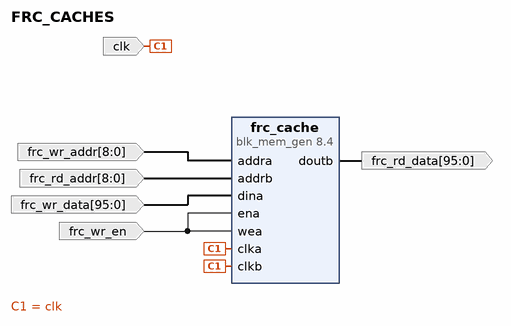
[diagram p0: block diagram of the top level]
# Vivado block design FRC_CACHES, xcu280-fsvh2892-2L-e, Vivado 2021.2
create_bd_design FRC_CACHES

create_bd_port -dir I -type clk clk
create_bd_port -dir I -from 8 -to 0 frc_rd_addr
create_bd_port -dir O -from 95 -to 0 frc_rd_data
create_bd_port -dir I -from 8 -to 0 frc_wr_addr
create_bd_port -dir I -from 95 -to 0 frc_wr_data
create_bd_port -dir I frc_wr_en

create_bd_cell -type ip -vlnv xilinx.com:ip:blk_mem_gen:8.4 frc_cache
set_property -dict [list \
  CONFIG.Assume_Synchronous_Clk true \
  CONFIG.Collision_Warnings ALL \
  CONFIG.Disable_Collision_Warnings false \
  CONFIG.Disable_Out_of_Range_Warnings false \
  CONFIG.Enable_32bit_Address false \
  CONFIG.Enable_B Always_Enabled \
  CONFIG.Fill_Remaining_Memory_Locations true \
  CONFIG.Memory_Type Simple_Dual_Port_RAM \
  CONFIG.Operating_Mode_A NO_CHANGE \
  CONFIG.Port_B_Clock 100 \
  CONFIG.Port_B_Enable_Rate 100 \
  CONFIG.Read_Width_B 96 \
  CONFIG.Register_PortB_Output_of_Memory_Primitives false \
  CONFIG.Use_Byte_Write_Enable false \
  CONFIG.Write_Depth_A 512 \
  CONFIG.Write_Width_A 96 \
  CONFIG.Write_Width_B 96 \
  CONFIG.use_bram_block Stand_Alone \
] [get_bd_cells frc_cache]

# ---- connections ----

connect_bd_net -net addra_1_1 [get_bd_ports frc_wr_addr] [get_bd_pins frc_cache/addra]
connect_bd_net -net addrb_1_1 [get_bd_ports frc_rd_addr] [get_bd_pins frc_cache/addrb]
connect_bd_net -net clka_0_1 [get_bd_ports clk] [get_bd_pins frc_cache/clka] [get_bd_pins frc_cache/clkb]
connect_bd_net -net dina_1_1 [get_bd_ports frc_wr_data] [get_bd_pins frc_cache/dina]
connect_bd_net -net ena_1_1 [get_bd_ports frc_wr_en] [get_bd_pins frc_cache/ena] [get_bd_pins frc_cache/wea]
connect_bd_net -net home_frc_cache_doutb [get_bd_pins frc_cache/doutb] [get_bd_ports frc_rd_data]

validate_bd_design
save_bd_design
